# Altium schematic sheet IoTMainBoard.SchDoc
size 406 x 304 mm
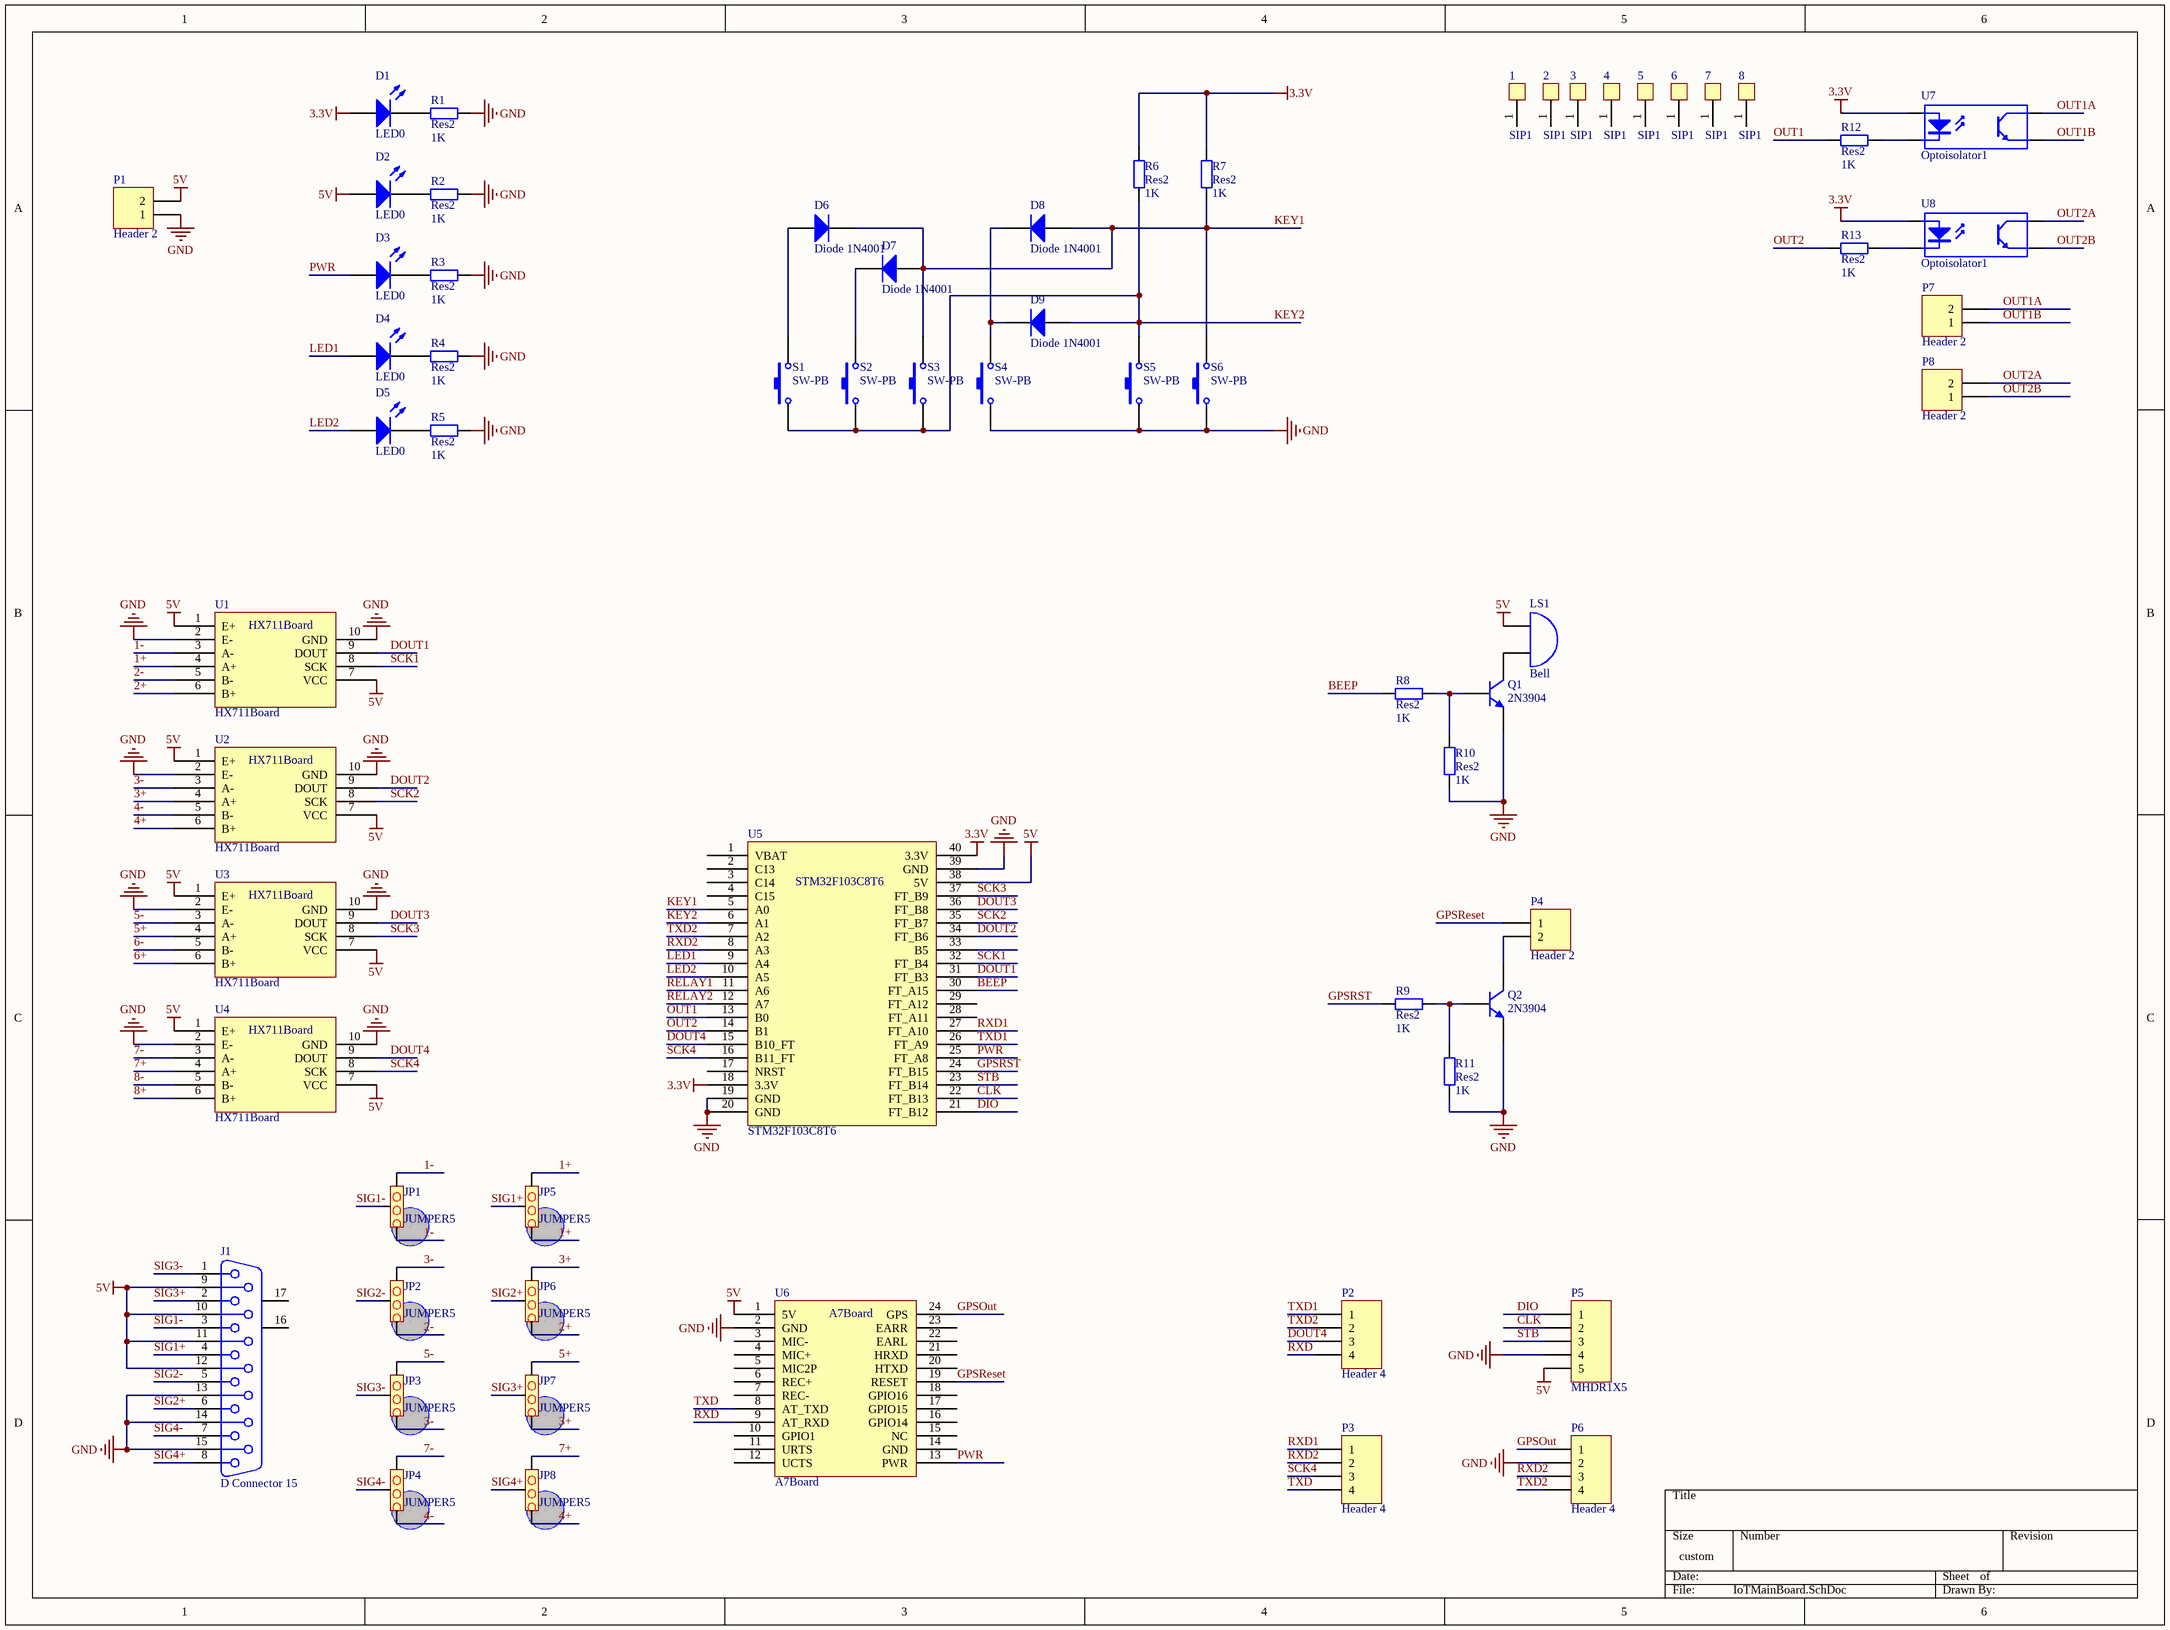
[diagram p0: IoTMainBoard.SchDoc]

## Parts
1  SIP1  [hole]
2  SIP1  [hole]
3  SIP1  [hole]
4  SIP1  [hole]
5  SIP1  [hole]
6  SIP1  [hole]
7  SIP1  [hole]
8  SIP1  [hole]
D1  LED0  [LED0]
D2  LED0  [LED0]
D3  LED0  [LED0]
D4  LED0  [LED0]
D5  LED0  [LED0]
D6  Diode 1N4001  [1N4148]
D7  Diode 1N4001  [1N4148]
D8  Diode 1N4001  [1N4148]
D9  Diode 1N4001  [1N4148]
J1  D Connector 15  [DB15F_DB]
JP1  JUMPER5  [CON3]
JP2  JUMPER5  [CON3]
JP3  JUMPER5  [CON3]
JP4  JUMPER5  [CON3]
JP5  JUMPER5  [CON3]
JP6  JUMPER5  [CON3]
JP7  JUMPER5  [CON3]
JP8  JUMPER5  [CON3]
LS1  Bell  [BEEP]
P1  Header 2  [Power2]
P2  Header 4  [JUMP3]
P3  Header 4  [JUMP3]
P4  Header 2  [HDR1X2]
P5  MHDR1X5  [HDR1X5]
P6  Header 4  [HDR1X4]
P7  Header 2  [HDR1X2]
P8  Header 2  [HDR1X2]
Q1  2N3904  [SOT-23]
Q2  2N3904  [SOT-23]
R1  Res2  value 1K  [0805]
R2  Res2  value 1K  [0805]
R3  Res2  value 1K  [0805]
R4  Res2  value 1K  [0805]
R5  Res2  value 1K  [0805]
R6  Res2  value 1K  [0805]
R7  Res2  value 1K  [0805]
R8  Res2  value 1K  [0805]
R9  Res2  value 1K  [0805]
R10  Res2  value 1K  [0805]
R11  Res2  value 1K  [0805]
R12  Res2  value 1K  [0805]
R13  Res2  value 1K  [0805]
S1  SW-PB  [KEY1]
S2  SW-PB  [KEY1]
S3  SW-PB  [KEY1]
S4  SW-PB  [KEY1]
S5  SW-PB  [KEY1]
S6  SW-PB  [KEY1]
U1  HX711Board  [HX711]
U2  HX711Board  [HX711]
U3  HX711Board  [HX711]
U4  HX711Board  [HX711]
U5  STM32F103C8T6  [STM32F103C8T6]
U6  A7Board  [A7Board]
U7  Optoisolator1  [SOP4]
U8  Optoisolator1  [SOP4]

## Nets
3.3V: D1.1(A) R6.2 R7.2 U5.18(3.3V) U5.40(3.3V) U7.1(A) U8.1(A)
5V: D2.1(A) J1.9 J1.10 J1.11 J1.12 LS1.1(A) P1.2 P5.5 U1.1(E+) U1.7(VCC) U2.1(E+) U2.7(VCC) U3.1(E+) U3.7(VCC) U4.1(E+) U4.7(VCC) U5.38(5V) U6.1(5V)
GND: J1.13 J1.14 J1.15 P1.1 P5.4 P6.2 Q1.1(E) Q2.1(E) R1.1 R2.1 R3.1 R4.1 R5.1 R10.2 R11.2 S4.1 S5.1 S6.1 U1.2(E-) U1.10(GND) U2.2(E-) U2.10(GND) U3.2(E-) U3.10(GND) U4.2(E-) U4.10(GND) U5.19(GND) U5.20(GND) U5.39(GND) U6.2(GND)
1+: JP5.1 JP5.3 U1.4(A+)
1-: JP1.1 JP1.3 U1.3(A-)
2+: JP6.1 U1.6(B+)
2-: JP2.1 U1.5(B-)
3+: JP6.3 JP7.1 U2.4(A+)
3-: JP2.3 JP3.1 U2.3(A-)
4+: JP8.1 U2.6(B+)
4-: JP4.1 U2.5(B-)
5+: JP7.3 U3.4(A+)
5-: JP3.3 U3.3(A-)
6+: U3.6(B+)
6-: U3.5(B-)
7+: JP8.3 U4.4(A+)
7-: JP4.3 U4.3(A-)
8+: U4.6(B+)
8-: U4.5(B-)
BEEP: R8.2 U5.30(FT_A15)
CLK: P5.2 U5.22(FT_B13)
DIO: P5.1 U5.21(FT_B12)
DOUT1: U1.9(DOUT) U5.31(FT_B3)
DOUT2: U2.9(DOUT) U5.34(FT_B6)
DOUT3: U3.9(DOUT) U5.36(FT_B8)
DOUT4: P2.3 U4.9(DOUT) U5.15(B10_FT)
GPSOut: P6.1 U6.24(GPS)
GPSReset: P4.1 U6.19(RESET)
GPSRST: R9.2 U5.24(FT_B15)
KEY1: D6.2(K) D7.1(A) D8.1(A) R7.1 S3.2 S6.2 U5.5(A0)
KEY2: D9.1(A) R6.1 S1.1 S2.1 S3.1 S5.2 U5.6(A1)
LED1: D4.1(A) U5.9(A4)
LED2: D5.1(A) U5.10(A5)
OUT1: R12.1 U5.13(B0)
OUT1A: P7.2 U7.4(C)
OUT1B: P7.1 U7.3(E)
OUT2: R13.1 U5.14(B1)
OUT2A: P8.2 U8.4(C)
OUT2B: P8.1 U8.3(E)
PWR: D3.1(A) U5.25(FT_A8) U6.13(PWR)
RELAY1: U5.11(A6)
RELAY2: U5.12(A7)
RXD: P2.4 U6.9(AT_RXD)
RXD1: P3.1 U5.27(FT_A10)
RXD2: P3.2 P6.3 U5.8(A3)
SCK1: U1.8(SCK) U5.32(FT_B4)
SCK2: U2.8(SCK) U5.35(FT_B7)
SCK3: U3.8(SCK) U5.37(FT_B9)
SCK4: P3.3 U4.8(SCK) U5.16(B11_FT)
SIG1+: J1.4 JP5.2
SIG1-: J1.3 JP1.2
SIG2+: J1.6 JP6.2
SIG2-: J1.5 JP2.2
SIG3+: J1.2 JP7.2
SIG3-: J1.1 JP3.2
SIG4+: J1.8 JP8.2
SIG4-: J1.7 JP4.2
STB: P5.3 U5.23(FT_B14)
TXD: P3.4 U6.8(AT_TXD)
TXD1: P2.1 U5.26(FT_A9)
TXD2: P2.2 P6.4 U5.7(A2)
NetD1_2: D1.2(K) R1.2
NetD2_2: D2.2(K) R2.2
NetD3_2: D3.2(K) R3.2
NetD4_2: D4.2(K) R4.2
NetD5_2: D5.2(K) R5.2
NetD6_1: D6.1(A) S1.2
NetD7_2: D7.2(K) S2.2
NetD8_2: D8.2(K) D9.2(K) S4.2
NetLS1_2: LS1.2(B) Q1.3(C)
NetP4_2: P4.2 Q2.3(C)
NetQ1_2: Q1.2(B) R8.1 R10.1
NetQ2_2: Q2.2(B) R9.1 R11.1
NetR12_2: R12.2 U7.2(K)
NetR13_2: R13.2 U8.2(K)

Not connected (* = marked no-connect by the designer): 1 1; 2 1; 3 1; 4 1; 5 1; 6 1; 7 1; 8 1; J1 16(MH1) 17(MH2); U5 1(VBAT) 2(C13) 3(C14) 4(C15) 17(NRST) 28(FT_A11) 29(FT_A12) 33(B5); U6 3(MIC-) 4(MIC+) 5(MIC2P) 6(REC+) 7(REC-) 10(GPIO1) 11(URTS) 12(UCTS) 14(GND) 15(NC) 16(GPIO14) 17(GPIO15) 18(GPIO16) 20(HTXD) 21(HRXD) 22(EARL) 23(EARR)

## Library data of the parts
1-8 = SIP1: Variable Resistor; Set Position: 0.5; Published: 8-Jun-2000; LatestRevisionDate: 17-Jul-2002; LatestRevisionNote: Re-released for DXP Platform.; PackageReference: AXIAL-0.6; Publisher: Altium Limited
D1-D5 = LED0: Typical INFRARED GaAs LED; Published: 8-Jun-2000; LatestRevisionDate: 08-Jul-2005; LatestRevisionNote: Mech Layer 1 removed.; PackageReference: LED-0; Publisher: Altium Limited; PackageDescription: LED; 2 Leads
D6-D9 = Diode 1N4001: 1 Amp General Purpose Rectifier; Published: 8-Jun-2000; LatestRevisionDate: 17-Jul-2002; LatestRevisionNote: Re-released for DXP Platform.; DatasheetVersion: 1998; PackageVersion: Aug-1999; PackageReference: DO-41; Publisher: Altium Limited; PackageDescription: Diode, Axial; Body 5.2 x 2.7 mm (LxDia. max), Lead Dia. 0.86 mm (max); Code_JEDEC: DO-204-AL; ComponentLink1Description: Manufacturer Link; ComponentLink1URL: http://www.fairchildsemi.com/; ComponentLink2Description: Datasheet; ComponentLink2URL: http://www.fairchildsemi.com/ds/1N%2F1N4001.pdf
J1 = D Connector 15: Receptacle Assembly, 15 Position, Right Angle; PackageDocument: O; Positions: 15; Published: 15-Jun-2001; LatestRevisionDate: 17-Jul-2002; LatestRevisionNote: Re-released for DXP Platform.; DatasheetDocument: 1-Sep-99; PackageReference: 788757; Publisher: Altium Limited; Orientation: Right Angle; Gender: Receptacle
LS1 = Bell: Electrical Bell; Published: 24-Mar-1999; LatestRevisionDate: 17-Jul-2002; LatestRevisionNote: Re-released for DXP Platform.; PackageReference: PIN2; Publisher: Altium Limited
P1 P4 P7 P8 = Header 2: Header, 2-Pin; LatestRevisionDate: 17-Jul-2002; LatestRevisionNote: Re-released for DXP Platform.; Publisher: Altium Limited
P2 P3 P6 = Header 4: Header, 4-Pin; LatestRevisionDate: 17-Jul-2002; LatestRevisionNote: Re-released for DXP Platform.; Publisher: Altium Limited
P5 = MHDR1X5: Header, 5-Pin; LatestRevisionDate: 17-Jul-2002; LatestRevisionNote: Re-released for DXP Platform.; Publisher: Altium Limited
Q1 Q2 = 2N3904: NPN General Purpose Amplifier; Published: 8-Jun-2000; LatestRevisionDate: 15-Jan-2003; LatestRevisionNote: PCB Footprint 'BCY-W3/D4.7' replaced; DatasheetVersion: 1997; PackageVersion: Sep-1998; PackageReference: TO-92A; Publisher: Altium Limited; PackageDescription: TO, Flat Index; 3 In-Line, Axial Leads; Body Dia. 4.5mm; Leads 0.51 x 0.48 mm (max); ComponentLink1Description: Manufacturer Link; ComponentLink1URL: http://www.fairchildsemi.com/; ComponentLink2Description: Datasheet; ComponentLink2URL: http://www.fairchildsemi.com/ds/2N%2F2N3904.pdf
R1-R13 = Res2: Resistor; Published: 8-Jun-2000; LatestRevisionDate: 17-Jul-2002; LatestRevisionNote: Re-released for DXP Platform.; PackageReference: AXIAL-0.4; Publisher: Altium Limited; PackageDescription: Axial Device, Thru-Hole; 2 Leads; 0.4 in Pin Spacing
S1-S6 = SW-PB: Switch; Published: 24-Mar-1999; LatestRevisionDate: 17-Jul-2002; LatestRevisionNote: Re-released for DXP Platform.; PackageReference: SPST-2; Publisher: Altium Limited; PackageDescription: Switch; 2 Leads
U5 = STM32F103C8T6: STM32F103C8T6 Board
U7 U8 = Optoisolator1: 4-Pin Phototransistor Optocoupler; Published: 24-Mar-1999; LatestRevisionDate: 04-Mar-2005; LatestRevisionNote: Sch pins 3 & 4 Swapped.; DatasheetVersion: Nov-2003; PackageReference: DIP-4; Publisher: Altium Limited